# Altium schematic sheet sensor_output.SchDoc: Sensor and outputs.
size A3; Hw_rev: 0; License: GPLv3; Address3: Firenze; Address4: ITALY; DocumentNumber: 5; Revision: 0; SheetNumber: 5; SheetTotal: 8
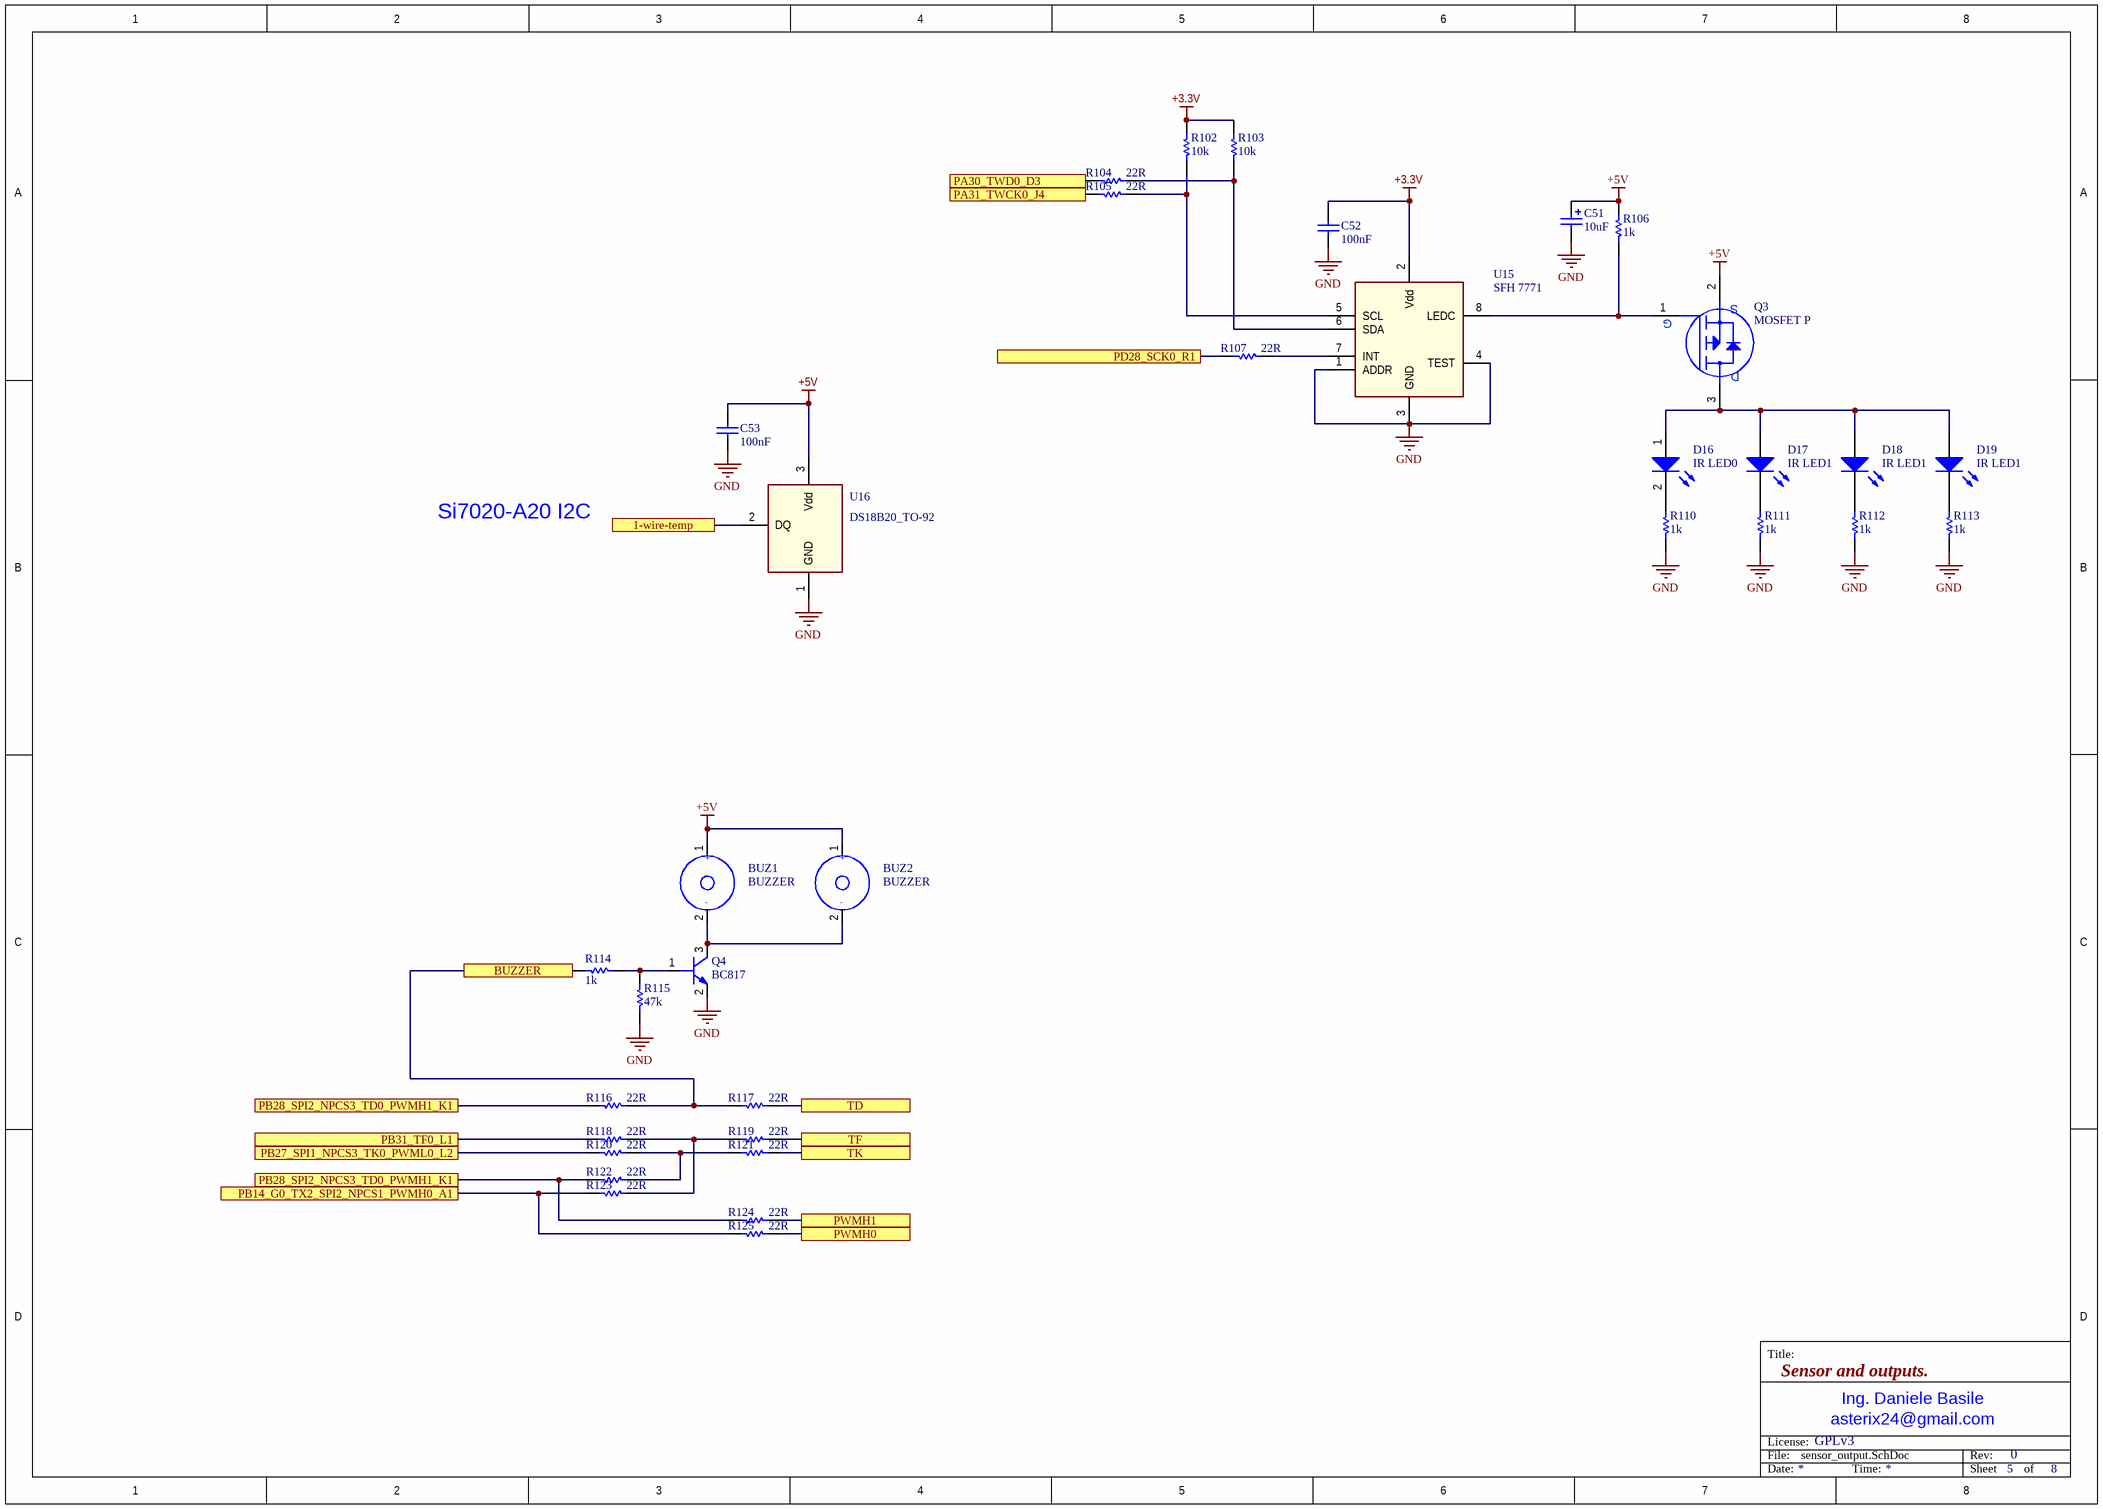
[diagram p0: sensor_output.SchDoc]

## Parts
BUZ1  BUZZER  [buzzer_14mm_thd]
BUZ2  BUZZER  [BUZZER_9x9MM_SMD]
C51  10uF  [1206_[3216]]
C52  100nF  [0603_[1608]]
C53  100nF  [0603_[1608]]
D16  IR LED0  [0603_[1608]_K2-A1_LED]
D17  IR LED1  [0603_[1608]_K2-A1_LED]
D18  IR LED1  [0603_[1608]_K2-A1_LED]
D19  IR LED1  [0603_[1608]_K2-A1_LED]
Q3  MOSFET P  [SOT-23]
Q4  BC817  [SOT-23]
R102  10k  [0603_[1608]]
R103  10k  [0603_[1608]]
R104  22R  [0603_[1608]]
R105  22R  [0603_[1608]]
R106  1k  [0603_[1608]]
R107  22R  [0603_[1608]]
R110  1k  [0603_[1608]]
R111  1k  [0603_[1608]]
R112  1k  [0603_[1608]]
R113  1k  [0603_[1608]]
R114  1k  [0603_[1608]]
R115  47k  [0603_[1608]]
R116  22R  [0603_[1608]]
R117  22R  [0603_[1608]]
R118  22R  [0603_[1608]]
R119  22R  [0603_[1608]]
R120  22R  [0603_[1608]]
R121  22R  [0603_[1608]]
R122  22R  [0603_[1608]]
R123  22R  [0603_[1608]]
R124  22R  [0603_[1608]]
R125  22R  [0603_[1608]]
U15  SFH 7771  [QFN_SFH7771]
U16  DS18B20_TO-92  [TO-92]

## Ports
1-wire-temp, BUZZER, PA30_TWD0_D3, PA31_TWCK0_J4, PB14_G0_TX2_SPI2_NPCS1_PWMH0_A1, PB27_SPI1_NPCS3_TK0_PWML0_L2, PB28_SPI2_NPCS3_TD0_PWMH1_K1, PB31_TF0_L1, PD28_SCK0_R1, PWMH0, PWMH1, TD, TF, TK

## Nets
+3.3V: C52.2 R102.1 R103.1 U15.2(Vdd)
+5V: BUZ1.1 BUZ2.1 C51.1 C53.2 Q3.2(S) R106.1 U16.3(Vdd)
GND: C51.2 C52.1 C53.1 Q4.2(E) R110.2 R111.2 R112.2 R113.2 R115.2 U15.1(ADDR) U15.3(GND) U15.4(TEST) U16.1(GND)
1-wire-temp: U16.2(DQ) ; port 1-wire-temp
BUZZER: R114.2 R116.1 R117.2 ; port BUZZER
PA30_TWD0_D3: R104.2 ; port PA30_TWD0_D3
PA31_TWCK0_J4: R105.2 ; port PA31_TWCK0_J4
PB14_G0_TX2_SPI2_NPCS1_PWMH0_A1: R123.2 R125.2 ; port PB14_G0_TX2_SPI2_NPCS1_PWMH0_A1
PB27_SPI1_NPCS3_TK0_PWML0_L2: R120.2 ; port PB27_SPI1_NPCS3_TK0_PWML0_L2
PB28_SPI2_NPCS3_TD0_PWMH1_K1: R116.2 R122.2 R124.2 ; port PB28_SPI2_NPCS3_TD0_PWMH1_K1
PB31_TF0_L1: R118.2 ; port PB31_TF0_L1
PD28_SCK0_R1: R107.2 ; port PD28_SCK0_R1
PWMH0: R125.1 ; port PWMH0
PWMH1: R124.1 ; port PWMH1
TD: R117.1 ; port TD
TF: R119.1 ; port TF
TK: R121.1 ; port TK
NetBUZ1_2: BUZ1.2 BUZ2.2 Q4.3(C)
NetD16_1: D16.1(A) D17.1(A) D18.1(A) D19.1(A) Q3.3(D)
NetD16_2: D16.2(K) R110.1
NetD17_2: D17.2(K) R111.1
NetD18_2: D18.2(K) R112.1
NetD19_2: D19.2(K) R113.1
NetQ3_1: Q3.1(G) R106.2 U15.8(LEDC)
NetQ4_1: Q4.1(B) R114.1 R115.1
NetR102_2: R102.2 R105.1 U15.5(SCL)
NetR103_2: R103.2 R104.1 U15.6(SDA)
NetR107_1: R107.1 U15.7(INT)
NetR118_1: R118.1 R119.2 R123.1
NetR120_1: R120.1 R121.2 R122.1

## Notes on the sheet
- Si7020-A20 I2C
- Title:
- File:
- License:
- asterix24@gmail.com
- Ing. Daniele Basile
- Rev:
- Date:
- Time:
- Sheet
- of
- (in symbol BUZZER) +; -

## Library data of the parts
C51 = Cap Pol1: Ceramic X5R 25V; Published: 8-Jun-2000; Revision: July-2002: Re-released for DXP Platform.; Publisher: Altium Limited; Value: 10uF
C52 C53 = Cap: Ceramic X7R 50V; Value: 100pF; Published: 8-Jun-2000; LatestRevisionDate: 17-Jul-2002; LatestRevisionNote: Re-released for DXP Platform.; PackageReference: RAD-0.3; Publisher: Altium Limited; PackageDescription: Radial Cap, Thru-Hole; 2 Leads; 0.3 in Pin Spacing
D16-D19 = LED0: LED Green; Published: 8-Jun-2000; LatestRevisionDate: 08-Jul-2005; LatestRevisionNote: Mech Layer 1 removed.; PackageReference: LED-0; Publisher: Altium Limited; PackageDescription: LED; 2 Leads
Q3 = MOSFET-P 3pin: MOSFET channel P
Q4 = BC817: BJT NPN
R102-R107 R110-R114 R116-R125 = Res1: Resistor; Revision: July-2002: Re-released for DXP Platform.
  R114: Published: 8-Jun-2000; Publisher: Altium Limited; Value: 1K
R115 = Res1: Resistor; Value: 1K; Published: 8-Jun-2000; Revision: July-2002: Re-released for DXP Platform.; Publisher: Altium Limited
U15 = SFH 7771: OSRAM Integrated Ambient Light and Proximity Sensors
U16 = DS18B20_TO-92: 1-Wire temperature sensor.